# Altium schematic sheet dual+switch+for+layout.schdoc
size 229 x 184 mm
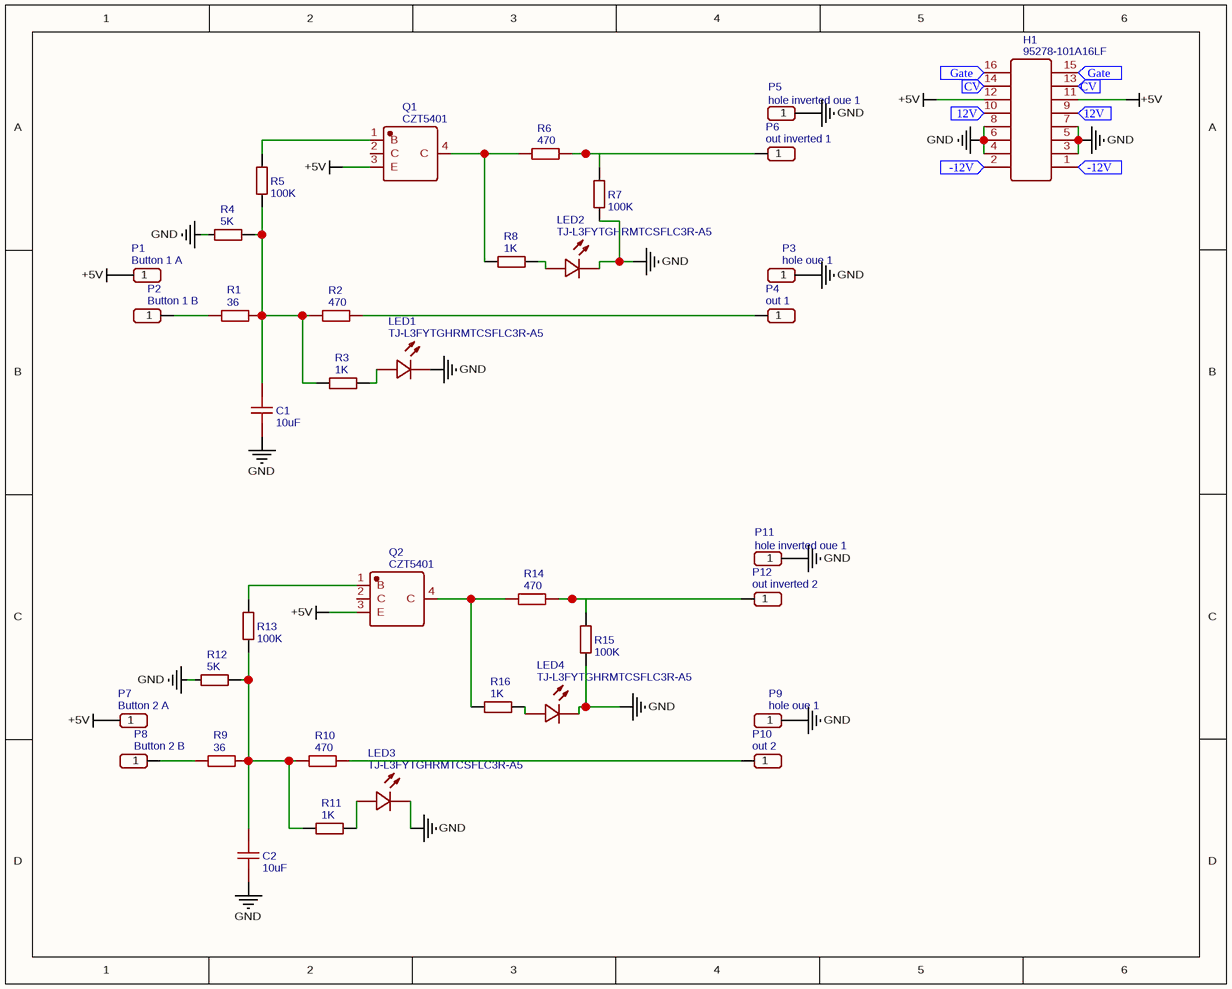
[diagram p0: dual+switch+for+layout.schdoc]

## Parts
C1  10uF  [1206]
C2  10uF  [1206]
H1  95278-101A16LF  [95278-101A16LF]
LED1  TJ-L3FYTGHRMTCSFLC3R-A5  [LED-DIP-3.8MM]
LED2  TJ-L3FYTGHRMTCSFLC3R-A5  [LED-DIP-3.8MM]
LED3  TJ-L3FYTGHRMTCSFLC3R-A5  [LED-DIP-3.8MM]
LED4  TJ-L3FYTGHRMTCSFLC3R-A5  [LED-DIP-3.8MM]
P1  Button 1 A  [PAD-SMD-C150]
P2  Button 1 B  [PAD-SMD-C150]
P3  hole oue 1  [MOUNTINGHOLE_8.4MM_M8_PAD]
P4  out 1  [PAD-SMD-C150]
P5  hole inverted oue 1  [MOUNTINGHOLE_8.4MM_M8_PAD]
P6  out inverted 1  [PAD-SMD-C150]
P7  Button 2 A  [PAD-SMD-C150]
P8  Button 2 B  [PAD-SMD-C150]
P9  hole oue 1  [MOUNTINGHOLE_8.4MM_M8_PAD]
P10  out 2  [PAD-SMD-C150]
P11  hole inverted oue 1  [MOUNTINGHOLE_8.4MM_M8_PAD]
P12  out inverted 2  [PAD-SMD-C150]
Q1  CZT5401  [SOT-223]
Q2  CZT5401  [SOT-223]
R1  36  [2512]
R2  470  [2512]
R3  1K  [2512]
R4  5K  [0805]
R5  100K  [2512]
R6  470  [2512]
R7  100K  [2512]
R8  1K  [2512]
R9  36  [2512]
R10  470  [2512]
R11  1K  [2512]
R12  5K  [0805]
R13  100K  [2512]
R14  470  [2512]
R15  100K  [2512]
R16  1K  [2512]

## Ports
12V, -12V, CV, Gate

## Nets
+5V: H1.11 H1.12 P1.1 P7.1 Q1.3(E) Q2.3(E)
GND: C1.2 C2.2 H1.3 H1.4 H1.5 H1.6 H1.7 H1.8 LED1.2 LED2.2 LED3.2 LED4.2 P3.1 P5.1 P9.1 P11.1 R4.1 R7.1 R12.1 R15.1
12V: H1.9 H1.10 ; port 12V
-12V: H1.1 H1.2 ; port -12V
CV: H1.13 H1.14 ; port CV
Gate: H1.15 H1.16 ; port Gate
NetC1_1: C1.1 R1.2 R2.1 R3.1 R4.2 R5.1
NetC2_1: C2.1 R9.2 R10.1 R11.1 R12.2 R13.1
NetLED1_1: LED1.1 R3.2
NetLED2_1: LED2.1 R8.2
NetLED3_1: LED3.1 R11.2
NetLED4_1: LED4.1 R16.2
NetP2_1: P2.1 R1.1
NetP4_1: P4.1 R2.2
NetP6_1: P6.1 R6.2 R7.2
NetP8_1: P8.1 R9.1
NetP10_1: P10.1 R10.2
NetP12_1: P12.1 R14.2 R15.2
NetQ1_1: Q1.1(B) R5.2
NetQ1_4: Q1.4(C) R6.1 R8.1
NetQ2_1: Q2.1(B) R13.2
NetQ2_4: Q2.4(C) R14.1 R16.1

Not connected (* = marked no-connect by the designer): Q1 2(C); Q2 2(C)

## Library data of the parts
C1 C2 = 10uF: BOM_Manufacturer: SAMSUNG; BOM_Manufacturer Part: CL31A106KPHNNNE; nameAlias: Capacitance; Contributor: LCSC; BOM_Supplier: LCSC; BOM_Supplier Part: C159760; spicePre: C; spiceSymbolName: CL31A106KPHNNNE
H1 = 95278-101A16LF: BOM_Manufacturer: Amphenol ICC; Contributor: LCSC; BOM_Supplier: LCSC; BOM_Supplier Part: C188235; BOM_Manufacturer Part: 95278-101A16LF; spicePre: H
LED1-LED4 = TJ-L3FYTGHRMTCSFLC3R-A5: BOM_Manufacturer: TOGIALED; Contributor: LCSC; BOM_Supplier: LCSC; BOM_Supplier Part: C331035; BOM_Manufacturer Part: TJ-L3FYTGHRMTCSFLC3R-A5; spicePre: L
P1 = Button 1 A: BOM_Manufacturer: ReliaPro; BOM_Manufacturer Part: Header-Male-2.54_1x1; BOM_Supplier: LCSC; BOM_Supplier Part: C81276; spicePre: P
P2 = Button 1 B: BOM_Manufacturer: ReliaPro; BOM_Manufacturer Part: Header-Male-2.54_1x1; BOM_Supplier: LCSC; BOM_Supplier Part: C81276; spicePre: P
P3 P9 = hole oue 1: BOM_Manufacturer: ReliaPro; BOM_Manufacturer Part: Header-Male-2.54_1x1; BOM_Supplier: LCSC; BOM_Supplier Part: C81276; spicePre: P
P4 = out 1: BOM_Manufacturer: ReliaPro; BOM_Manufacturer Part: Header-Male-2.54_1x1; BOM_Supplier: LCSC; BOM_Supplier Part: C81276; spicePre: P
P5 P11 = hole inverted oue 1: BOM_Manufacturer: ReliaPro; BOM_Manufacturer Part: Header-Male-2.54_1x1; BOM_Supplier: LCSC; BOM_Supplier Part: C81276; spicePre: P
P6 = out inverted 1: BOM_Manufacturer: ReliaPro; BOM_Manufacturer Part: Header-Male-2.54_1x1; BOM_Supplier: LCSC; BOM_Supplier Part: C81276; spicePre: P
P7 = Button 2 A: BOM_Manufacturer: ReliaPro; BOM_Manufacturer Part: Header-Male-2.54_1x1; BOM_Supplier: LCSC; BOM_Supplier Part: C81276; spicePre: P
P8 = Button 2 B: BOM_Manufacturer: ReliaPro; BOM_Manufacturer Part: Header-Male-2.54_1x1; BOM_Supplier: LCSC; BOM_Supplier Part: C81276; spicePre: P
P10 = out 2: BOM_Manufacturer: ReliaPro; BOM_Manufacturer Part: Header-Male-2.54_1x1; BOM_Supplier: LCSC; BOM_Supplier Part: C81276; spicePre: P
P12 = out inverted 2: BOM_Manufacturer: ReliaPro; BOM_Manufacturer Part: Header-Male-2.54_1x1; BOM_Supplier: LCSC; BOM_Supplier Part: C81276; spicePre: P
Q1 Q2 = CZT5401: BOM_Manufacturer: Changjiang Electronics Tech (CJ); Contributor: LCSC; SMT Type: Extend; BOM_Supplier: LCSC; BOM_Supplier Part: C189430; BOM_Manufacturer Part: CZT5401; BOM_LCSC Assembly: Yes; spicePre: Q
R1 R9 = 36: BOM_Manufacturer: Uniroyal Elec; BOM_Manufacturer Part: 25121WF360JT4E; nameAlias: Resistance (Ohms); Contributor: LCSC; SMT Type: Extend; BOM_Supplier: LCSC; BOM_Supplier Part: C190228; BOM_LCSC Assembly: Yes; spicePre: R; spiceSymbolName: 25121WF360JT4E
R2 R6 R10 R14 = 470: BOM_Manufacturer: ResistorToday; BOM_Manufacturer Part: AECR2512F470RK9; nameAlias: Resistance (Ohms); Contributor: LCSC; BOM_Supplier: LCSC; BOM_Supplier Part: C351718; spicePre: R; spiceSymbolName: AECR2512F470RK9
R3 R8 R11 R16 = 1K: BOM_Manufacturer: YAGEO; BOM_Manufacturer Part: RC2512JK-071KL; nameAlias: Resistance (Ohms); BOM_Supplier: LCSC; BOM_Supplier Part: C137010; spicePre: R; spiceSymbolName: RC2512JK-071KL
R4 R12 = 5K: BOM_Manufacturer: UniOhm; BOM_Manufacturer Part: TC0525B5001T5E; nameAlias: Resistance (Ohms); SMT Type: Extend; BOM_Supplier: LCSC; BOM_Supplier Part: C78980; BOM_LCSC Assembly: Yes; spicePre: R; spiceSymbolName: TC0525B5001T5E
R5 R7 R13 R15 = 100K: BOM_Manufacturer: UniOhm; BOM_Manufacturer Part: 25121WJ0104T4E; nameAlias: Resistance (Ohms); BOM_Supplier: LCSC; BOM_Supplier Part: C25717; spicePre: R; spiceSymbolName: 25121WJ0104T4E